# EAGLE design H-Bridge (EAGLE 9.5.1)
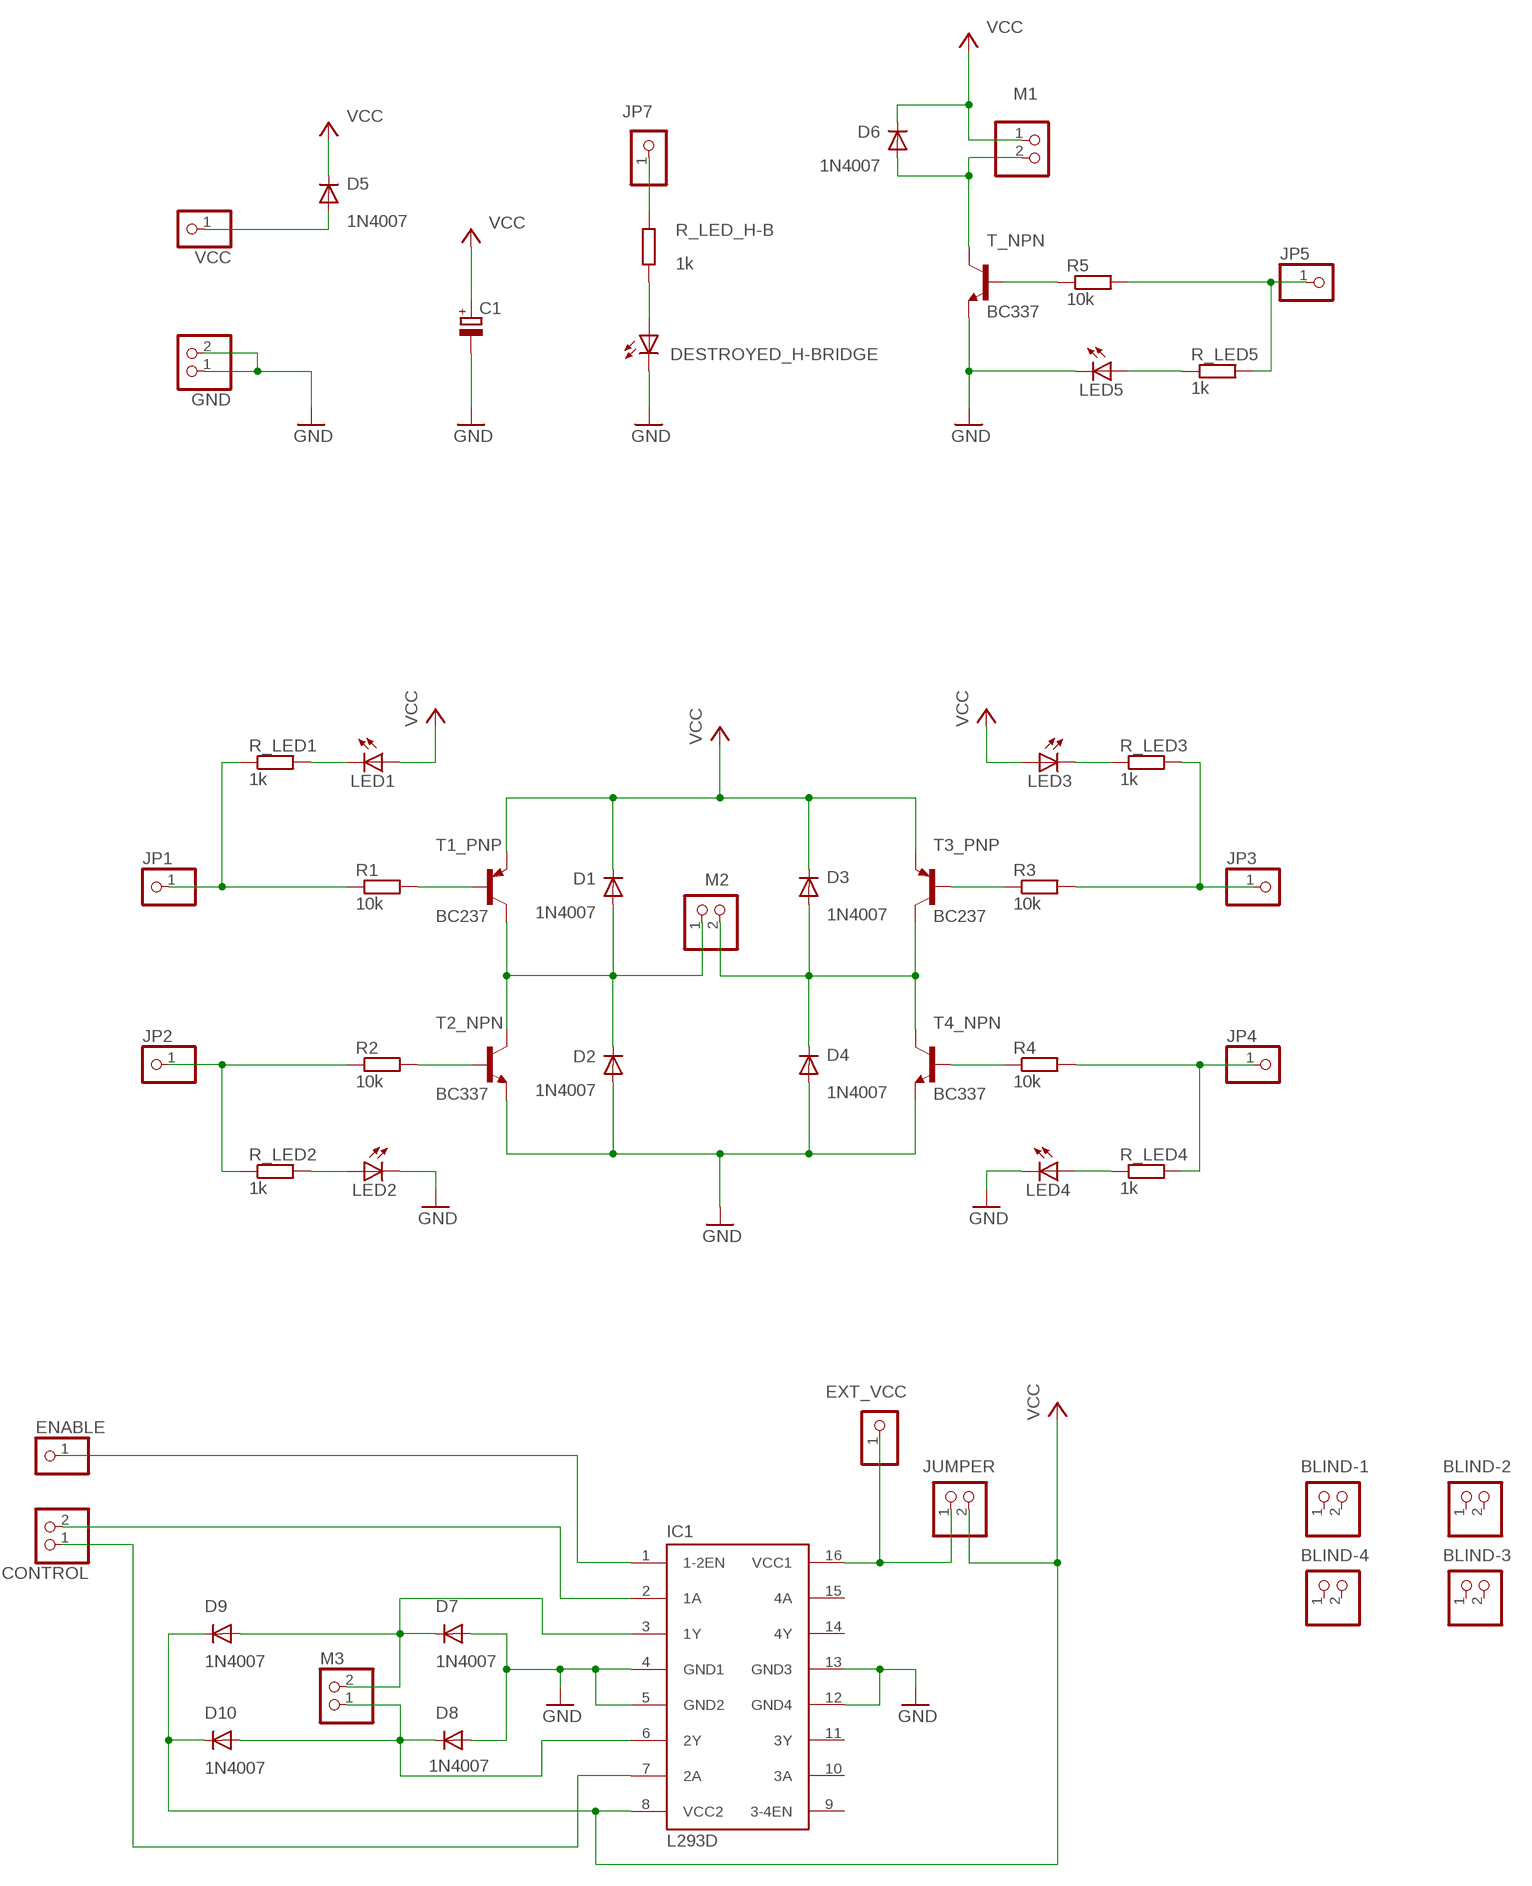
[diagram p0: schematic, sheet 1]

## Parts
BLIND-1  PINHD-1X2  [1X02]
BLIND-2  PINHD-1X2  [1X02]
BLIND-3  PINHD-1X2  [1X02]
BLIND-4  PINHD-1X2  [1X02]
C1  CPOL-EUE2.5-7  [E2,5-7]
CONTROL  PINHD-1X2  [1X02]
D1  1N4007  1N4004  [DO41-10]
D2  1N4007  1N4004  [DO41-10]
D3  1N4007  1N4004  [DO41-10]
D4  1N4007  1N4004  [DO41-10]
D5  1N4007  1N4004  [DO41-10]
D6  1N4007  1N4004  [DO41-10]
D7  1N4007  1N4004  [DO41-10]
D8  1N4007  1N4004  [DO41-10]
D9  1N4007  1N4004  [DO41-10]
D10  1N4007  1N4004  [DO41-10]
DESTROYED_H-BRIDGE  LED5MM  [LED5MM]
ENABLE  PINHD-1X1  [1X01]
EXT_VCC  PINHD-1X1  [1X01]
GND  PINHD-1X2  [1X02]
IC1  L293D  [DIL16]
JP1  PINHD-1X1  [1X01]
JP2  PINHD-1X1  [1X01]
JP3  PINHD-1X1  [1X01]
JP4  PINHD-1X1  [1X01]
JP5  PINHD-1X1  [1X01]
JP7  PINHD-1X1  [1X01]
JUMPER  PINHD-1X2  [1X02]
LED1  LED5MM  [LED5MM]
LED2  LED5MM  [LED5MM]
LED3  LED5MM  [LED5MM]
LED4  LED5MM  [LED5MM]
LED5  LED5MM  [LED5MM]
M1  PINHD-1X2  [1X02]
M2  PINHD-1X2  [1X02]
M3  PINHD-1X2  [1X02]
R1  10k  R-EU_0207/12  [0207/12]
R2  10k  R-EU_0207/12  [0207/12]
R3  10k  R-EU_0207/12  [0207/12]
R4  10k  R-EU_0207/12  [0207/12]
R5  10k  R-EU_0207/12  [0207/12]
R_LED1  1k  R-EU_0207/12  [0207/12]
R_LED2  1k  R-EU_0207/12  [0207/12]
R_LED3  1k  R-EU_0207/12  [0207/12]
R_LED4  1k  R-EU_0207/12  [0207/12]
R_LED5  1k  R-EU_0207/12  [0207/12]
R_LED_H-B  1k  R-EU_0207/12  [0207/12]
T1_PNP  BC237  -PNP-TO92-CBE  [TO92-CBE]
T2_NPN  BC337  BC337-40-NPN-TO92-CBE  [TO92-CBE]
T3_PNP  BC237  -PNP-TO92-CBE  [TO92-CBE]
T4_NPN  BC337  BC337-40-NPN-TO92-CBE  [TO92-CBE]
T_NPN  BC337  BC337-40-NPN-TO92-CBE  [TO92-CBE]
VCC  PINHD-1X1  [1X01]

## Nets
GND: C1.- D2.A D4.A D7.A D8.A DESTROYED_H-BRIDGE.K(C) GND.1 GND.2 IC1.4(GND1) IC1.5(GND2) IC1.12(GND4) IC1.13(GND3) LED2.K(C) LED4.K(C) LED5.K(C) T2_NPN.E T4_NPN.E T_NPN.E
N$1: D1.A D2.C M2.1 T1_PNP.C T2_NPN.C
N$2: JP1.1 R1.1 R_LED1.1
N$3: D3.A D4.C M2.2 T3_PNP.C T4_NPN.C
N$4: R1.2 T1_PNP.B
N$5: LED1.K(C) R_LED1.2
N$6: LED2.A R_LED2.2
N$7: JP2.1 R2.1 R_LED2.1
N$8: R2.2 T2_NPN.B
N$9: R3.1 T3_PNP.B
N$10: LED3.K(C) R_LED3.1
N$11: JP3.1 R3.2 R_LED3.2
N$12: R4.1 T4_NPN.B
N$13: JP4.1 R4.2 R_LED4.2
N$14: D5.A VCC.1
N$15: LED4.A R_LED4.1
N$16: JP7.1 R_LED_H-B.2
N$17: DESTROYED_H-BRIDGE.A R_LED_H-B.1
N$18: JP5.1 R5.2 R_LED5.2
N$19: R5.1 T_NPN.B
N$20: D8.C D10.A IC1.6(2Y) M3.1
N$21: LED5.A R_LED5.1
N$22: D6.A M1.2 T_NPN.C
N$23: ENABLE.1 IC1.1(1-2EN)
N$24: D7.C D9.A IC1.3(1Y) M3.2
N$25: EXT_VCC.1 IC1.16(VCC1) JUMPER.1
N$26: CONTROL.1 IC1.7(2A)
N$27: CONTROL.2 IC1.2(1A)
VCC: C1.+ D1.C D3.C D5.C D6.C D9.C D10.C IC1.8(VCC2) JUMPER.2 LED1.A LED3.A M1.1 T1_PNP.E T3_PNP.E
Unconnected: BLIND-1.1 BLIND-1.2 BLIND-2.1 BLIND-2.2 BLIND-3.1 BLIND-3.2 BLIND-4.1 BLIND-4.2 IC1.9(3-4EN) IC1.10(3A) IC1.11(3Y) IC1.14(4Y) IC1.15(4A)

## Library data of the parts
BLIND-1-BLIND-4 CONTROL GND JUMPER M1-M3 = pinhead:PINHD-1X2: PIN HEADER
C1 = rcl:CPOL-EU: POLARIZED CAPACITOR, European symbol; SPICEPREFIX: C
D1-D10 = adafruit:1N4004: DIODE General purpose 1N400x type rectifier (With bigger pads) http://www.ladyada.net/library/pcb/eaglelibrary.html
DESTROYED_H-BRIDGE LED1-LED5 = adafruit:LED: LED OSRAM: - CHIPLED LG R971, LG N971, LY N971, LG Q971, LY Q971, LO R971, LY R971 LH N974, LH R974 LS Q976, LO Q976, LY Q976 LO Q996 - Hyper CHIPLED LW Q18S LB Q993, LB Q99A, LB R99A - SideLED LS A670, LO A670, LY A670, LG A670, LP A670 LB A673, LV A673, LT A673, LW A673 LH A674 LY A675 LS A676, LA A676, LO A676, LY A676, LW A676 LS A679, LY A679, LG A679 - Hyper Micro SIDELED® LS Y876, LA Y876, LO Y876, LY Y876 LT Y87S - SmartLED LW L88C, LW L88S LB L89C, LB L89S, LG L890 LS L89K, LO L89K, LY L89K LS L896, LA L896, LO L896, LY L896 - TOPLED LS T670, LO T670, LY T670, LG T670, LP T670 LSG T670, LSP T670, LSY T670, LOP T670, LYG T670 LG T671, LOG T671, LSG T671 LB T673, LV T673, LT T673, LW T673 LH T674 LS T676, LA T676, LO T676, LY T676, LB T676, LH T676, LSB T676, LW T676 LB T67C, LV T67C, LT T67C, LS T67K, LO T67K, LY T67K, LW E67C LS E67B, LA E67B, LO E67B, LY E67B, LB E67C, LV E67C, LT E67C LW T67C LS T679, LY T679, LG T679 LS T770, LO T770, LY T770, LG T770, LP T770 LB T773, LV T773, LT T773, LW T773 LH T774 LS E675, LA E675, LY E675, LS T675 LS T776, LA T776, LO T776, LY T776, LB T776 LHGB T686 LT T68C, LB T68C - Hyper Mini TOPLED® LB M676 - Mini TOPLED Santana® LG M470 LS M47K, LO M47K, LY M47K Source: http://www.osram.convergy.de/
ENABLE EXT_VCC JP1-JP5 JP7 VCC = adafruit:PINHD-1X1: Pin header 1x1 for 0.1" spacing With round pins
IC1 = st-microelectronics:L293D: PUSH-PULL 4 CHANNEL DRIVER; MPN: L293D; OC_FARNELL: 9589619; OC_NEWARK: 56P8249
R1-R5 R_LED1-R_LED5 R_LED_H-B = rcl:R-EU_: RESISTOR, European symbol; SPICEPREFIX: R
T1_PNP T3_PNP = transistor-neu-to92:*-PNP-: PNP Transistror
T2_NPN T4_NPN T_NPN = transistor:*-NPN-: NPN Transistror BF959 corrected 2008.03.06

## Board
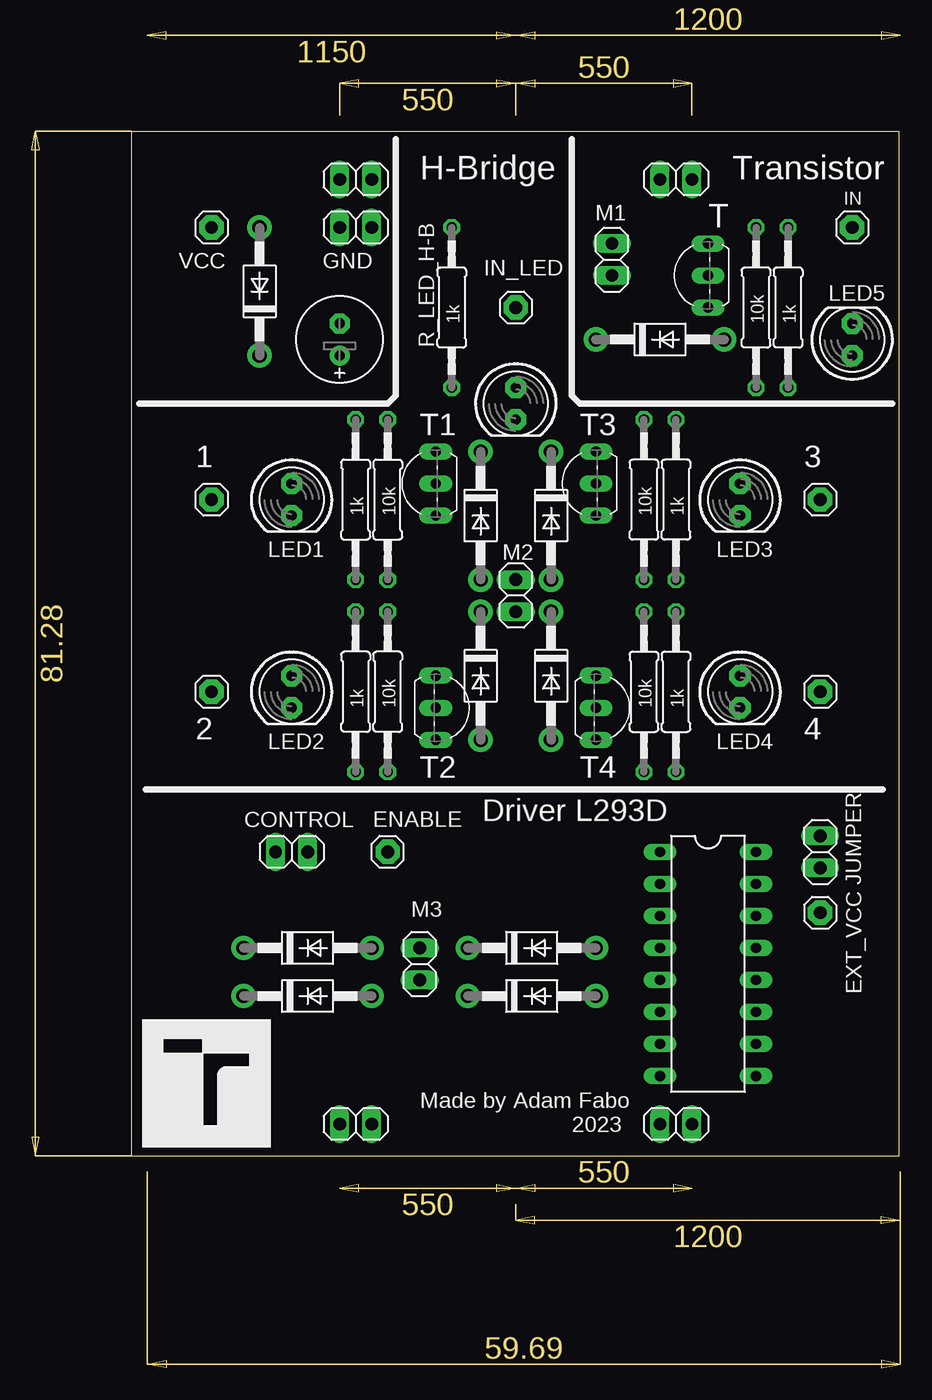
[diagram p1: board, top side]
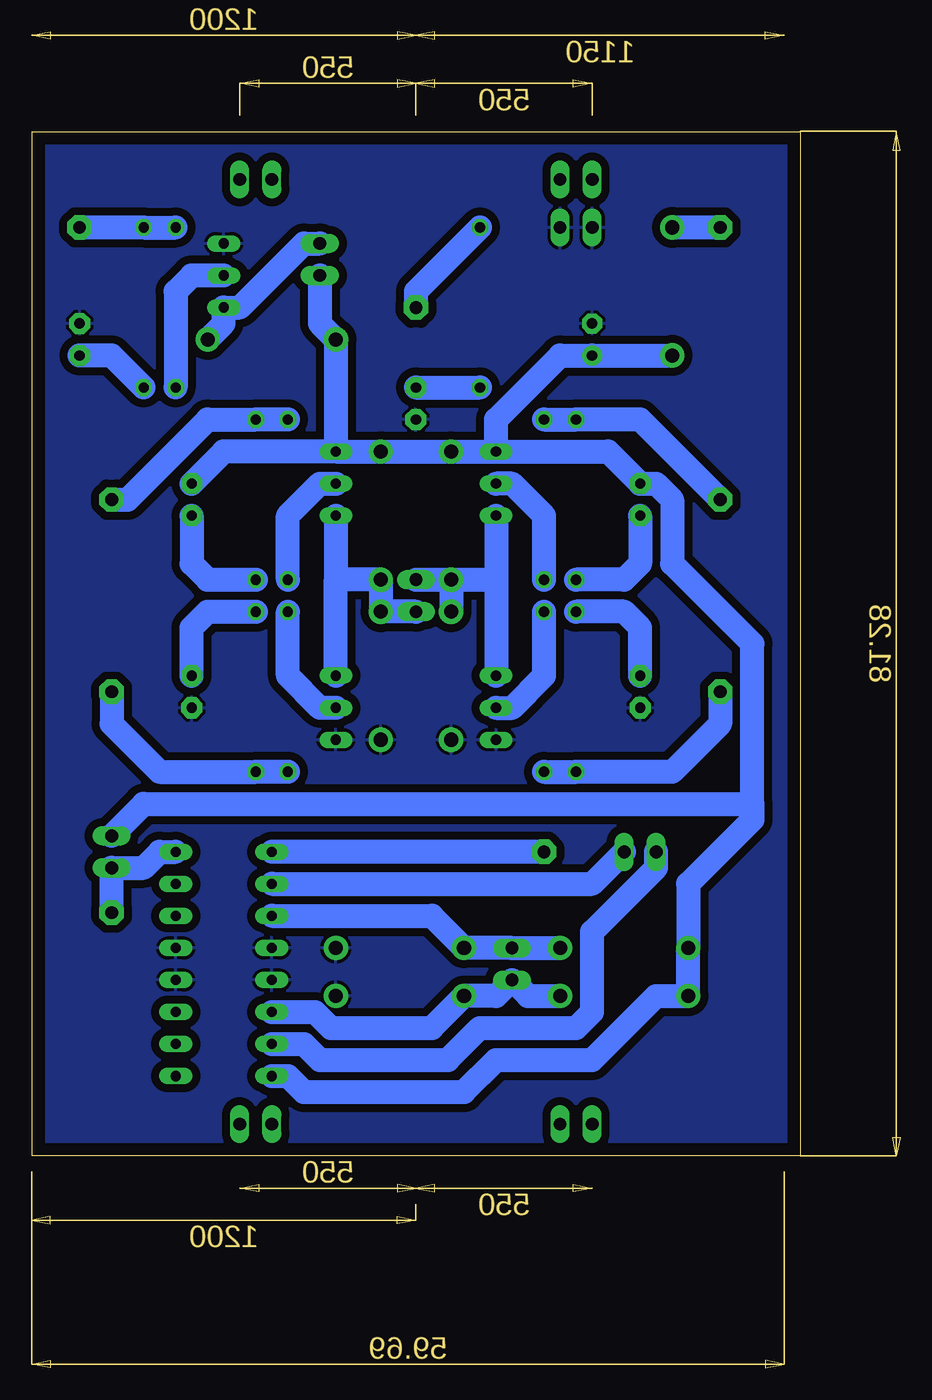
[diagram p2: board, bottom side, seen from below]

Size 60.88 x 81.27 mm. Coordinates in mm from the lower left corner, seen from the top.
Outline: 0,0 60.88,0 60.88,81.27 0,81.27 0,0
Copper layers (1*16): Top 0.035mm / dielectric 1.5mm / Bottom 0.035mm
Design rules "default": minimum track width 6mil, minimum drill 0.35mm, track to track 6mil, track to pad 6mil, pad to pad 6mil, via to via 6mil, smd to smd 6mil, copper to edge 40mil, drill to drill 6mil, minimum pad ring 10mil, minimum via ring 8mil, stop-mask expansion 4mil, vias tented up to drill 0mil, thermal gap 10mil

### Footprints (pad centres in the part's own frame; a part is rotated, then mirrored left to right if it is on the bottom)
1X02 = drill 1.016 long: 1 -1.27,0; 2 1.27,0
E2,5-7 = drill 0.813 pad 1.6: + -1.27,0 | drill 0.813 pad 1.6 octagon: - 1.27,0
DO41-10 = drill 1.118 pad 1.93: A 5.08,0; C -5.08,0
LED5MM = drill 0.813 pad 1.676 octagon: A -1.27,0; K 1.27,0
1X01 = drill 1.016 pad 1.93 octagon: 1 0,0
DIL16 = drill 0.813 long: 1 -8.89,-3.81; 2 -6.35,-3.81; 3 -3.81,-3.81; 4 -1.27,-3.81; 5 1.27,-3.81; 6 3.81,-3.81; 7 6.35,-3.81; 8 8.89,-3.81; 9 8.89,3.81; 10 6.35,3.81; 11 3.81,3.81; 12 1.27,3.81; 13 -1.27,3.81; 14 -3.81,3.81; 15 -6.35,3.81; 16 -8.89,3.81
0207/12 = drill 0.813 octagon: 1 -6.35,0; 2 6.35,0
TO92-CBE = drill 0.813 long: B 0,0; C -2.54,0; E 2.54,0

### Placement (x,y rotation side)
BLIND-1  43.18,77.47 0 top
BLIND-2  43.18,2.54 0 top
BLIND-3  17.78,2.54 0 top
BLIND-4  17.78,77.47 0 top
C1  16.51,64.77 90 top
CONTROL  12.7,24.13 0 top
D1  27.69,50.8 270 top
D2  27.69,38.1 270 top
D3  33.27,50.8 270 top
D4  33.27,38.1 270 top
D5  10.16,68.58 90 top
D6  41.91,64.77 0 top
D7  31.75,16.51 0 top
D8  31.75,12.7 0 top
D9  13.97,16.51 0 top
D10  13.97,12.7 0 top
DESTROYED_H-BRIDGE  30.48,59.69 270 top
ENABLE  20.32,24.13 180 top
EXT_VCC  54.61,19.3 0 top
GND  17.78,73.66 0 top
IC1  45.72,15.24 270 top
JP1  6.35,52.07 0 top
JP2  6.35,36.83 0 top
JP3  54.61,52.07 0 top
JP4  54.61,36.83 0 top
JP5  57.15,73.66 0 top
JP7  30.48,67.31 0 top
JUMPER  54.61,24.13 90 top
LED1  12.7,52.07 270 top
LED2  12.7,36.83 270 top
LED3  48.26,52.07 270 top
LED4  48.26,36.83 270 top
LED5  57.15,64.77 90 top
M1  38.1,71.12 90 top
M2  30.48,44.45 270 top
M3  22.86,15.24 90 top
R1  20.32,52.07 270 top
R2  20.32,36.83 90 top
R3  40.64,52.07 90 top
R4  40.64,36.83 270 top
R5  49.53,67.31 90 top
R_LED1  17.78,52.07 270 top
R_LED2  17.78,36.83 90 top
R_LED3  43.18,52.07 90 top
R_LED4  43.18,36.83 270 top
R_LED5  52.07,67.31 90 top
R_LED_H-B  25.4,67.31 90 top
T1_PNP  24.13,53.34 90 top
T2_NPN  24.13,35.56 270 top
T3_PNP  36.83,53.34 90 top
T4_NPN  36.83,35.56 270 top
T_NPN  45.72,69.85 90 top
VCC  6.35,73.66 0 top

### Tracks (layer width: path | path; a pad name or v marks a point on that pad's centre or on a via)
GND
  pour Bottom (isolate 0.635): 0,0 60.96,0 60.96,81.28 0,81.28
N$1
  Bottom 1.905: M2.1 D1.A | D1.A D2.C | D1.A 24.13,45.72 | 24.13,45.72 T2_NPN.C | T1_PNP.C 24.13,45.72
N$2
  Bottom 1.905: R1.1 R_LED1.1 12.7,58.42 JP1.1
N$3
  Bottom 1.905: M2.2 D4.C D3.A 36.83,45.72 | T4_NPN.C 36.83,45.72 | T3_PNP.C 36.83,45.72
N$4
  Bottom 1.905: R1.2 20.32,50.8 22.86,53.34 T1_PNP.B
N$5
  Bottom 1.905: R_LED1.2 13.97,45.72 12.7,46.99 LED1.K
N$6
  Bottom 1.905: LED2.A 12.7,41.91 13.97,43.18 R_LED2.2
N$7
  Bottom 1.905: R2.1 R_LED2.1 10.16,30.48 6.35,34.29 JP2.1
N$8
  Bottom 1.905: T2_NPN.B 22.86,35.56 20.32,38.1 R2.2
N$9
  Bottom 1.905: R3.1 40.64,50.8 38.1,53.34 T3_PNP.B
N$10
  Bottom 1.905: LED3.K 48.26,46.99 46.99,45.72 R_LED3.1
N$11
  Bottom 1.905: R3.2 R_LED3.2 46.99,58.42 53.34,52.07 JP3.1
N$12
  Bottom 1.905: T4_NPN.B 38.1,35.56 40.64,38.1 R4.1
N$13
  Bottom 1.905: R4.2 R_LED4.2 50.8,30.48 54.61,34.29 JP4.1
N$14
  Bottom 1.905: VCC.1 D5.A
N$15
  Bottom 1.905: R_LED4.1 46.99,43.18 48.26,41.91 LED4.A
N$16
  Bottom 1.905: R_LED_H-B.2 30.48,68.58 JP7.1
N$17
  Bottom 1.905: DESTROYED_H-BRIDGE.A R_LED_H-B.1
N$18
  Bottom 1.905: R5.2 R_LED5.2 JP5.1
N$19
  Bottom 1.905: T_NPN.B 48.26,69.85 49.53,68.58 R5.1
N$20
  Bottom 1.905: D10.A 21.59,12.7 M3.1 24.13,12.7 D8.C 29.21,10.16 37.22,10.16 38.49,11.43 IC1.6
N$21
  Bottom 1.905: R_LED5.1 54.61,63.5 LED5.A
N$22
  Bottom 1.905: D6.A 45.72,66.04 T_NPN.C 44.45,67.31 39.37,72.39 M1.2
N$23
  Bottom 1.905: ENABLE.1 IC1.1
N$24
  Bottom 1.905: D9.A M3.2 D7.C 29.21,19.05 IC1.3
N$25
  Bottom 1.905: EXT_VCC.1 JUMPER.1 52.07,22.86 50.8,24.13 IC1.16
N$26
  Bottom 1.905: IC1.7 39.37,8.89 38.1,7.62 27.94,7.62 25.4,10.16 17.78,10.16 16.51,11.43 16.51,17.78 11.43,22.86 CONTROL.1
N$27
  Bottom 1.905: CONTROL.2 16.51,21.59 IC1.2
VCC
  Bottom 1.905: M1.1 38.1,66.04 D6.C T3_PNP.E | D5.C C1.+ 19.05,63.5 24.13,58.42 T1_PNP.E | 3.81,27.94 3.81,40.64 10.16,46.99 10.16,52.07 11.43,53.34 LED1.A 15.24,55.88 T1_PNP.E | JUMPER.2 52.07,27.94 3.81,27.94 | 3.81,27.94 3.81,26.67 8.89,21.59 D9.C D10.C 11.43,12.7 16.51,7.62 24.13,7.62 26.67,5.08 39.37,5.08 40.64,6.35 IC1.8 | T1_PNP.E D1.C D3.C T3_PNP.E | LED3.A 45.72,55.88 T3_PNP.E

### Text on the board
tPlace: IN
tNames: H-Bridge | Transistor | T | IN_LED | 1k | 10k | 1k | T1 | T3 | 1 | 3 | 1k | 10k | 10k | 1k | 1k | 10k | 10k | 1k | 2 | 4 | T2 | T4 | Driver L293D | Made by Adam Fabo | 2023